# EAGLE design CircularControllerLEDs (EAGLE 8.0.0)
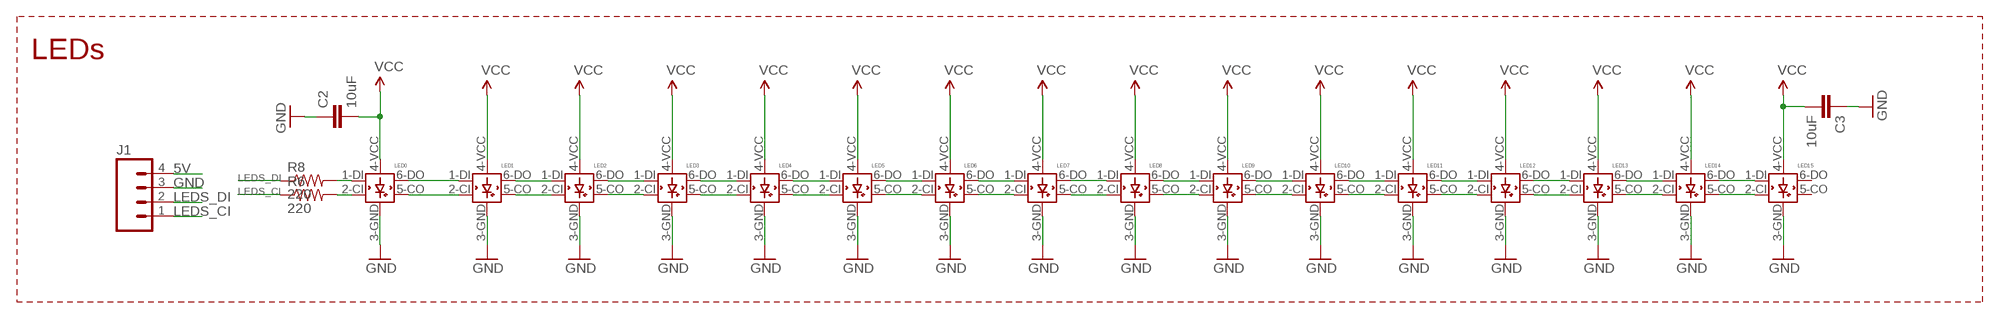
[diagram p0: schematic, sheet 1]

## Parts
C2  10uF  10UF-6.3V-20%(1206)  [1206]
C3  10uF  10UF-6.3V-20%(1206)  [1206]
J1  M04PTH  [1X04]
LED0  APA102  [5050]
LED1  APA102  [5050]
LED2  APA102  [5050]
LED3  APA102  [5050]
LED4  APA102  [5050]
LED5  APA102  [5050]
LED6  APA102  [5050]
LED7  APA102  [5050]
LED8  APA102  [5050]
LED9  APA102  [5050]
LED10  APA102  [5050]
LED11  APA102  [5050]
LED12  APA102  [5050]
LED13  APA102  [5050]
LED14  APA102  [5050]
LED15  APA102  [5050]
R6  220  RESISTOR1206  [1206]
R8  220  RESISTOR1206  [1206]

## Nets
5V: C2.2 J1.4 LED0.4-VCC(VCC) ; supply symbol labelled VCC
GND: C2.1 C3.1 J1.3 LED0.3-GND(GND) LED1.3-GND(GND) LED2.3-GND(GND) LED3.3-GND(GND) LED4.3-GND(GND) LED5.3-GND(GND) LED6.3-GND(GND) LED7.3-GND(GND) LED8.3-GND(GND) LED9.3-GND(GND) LED10.3-GND(GND) LED11.3-GND(GND) LED12.3-GND(GND) LED13.3-GND(GND) LED14.3-GND(GND) LED15.3-GND(GND)
LEDS_CI: J1.1 R6.1
LEDS_DI: J1.2 R8.1
N$1: LED0.1-DI(DI) R8.2
N$2: LED0.6-DO(DO) LED1.1-DI(DI)
N$3: LED0.2-CI(CI) R6.2
N$4: LED0.5-CO(CO) LED1.2-CI(CI)
N$5: LED1.6-DO(DO) LED2.1-DI(DI)
N$6: LED1.5-CO(CO) LED2.2-CI(CI)
N$7: LED2.6-DO(DO) LED3.1-DI(DI)
N$8: LED2.5-CO(CO) LED3.2-CI(CI)
N$9: LED3.5-CO(CO) LED4.2-CI(CI)
N$10: LED3.6-DO(DO) LED4.1-DI(DI)
N$11: LED4.6-DO(DO) LED5.1-DI(DI)
N$12: LED4.5-CO(CO) LED5.2-CI(CI)
N$13: LED5.6-DO(DO) LED6.1-DI(DI)
N$14: LED5.5-CO(CO) LED6.2-CI(CI)
N$15: LED6.6-DO(DO) LED7.1-DI(DI)
N$16: LED6.5-CO(CO) LED7.2-CI(CI)
N$17: LED7.5-CO(CO) LED8.2-CI(CI)
N$18: LED7.6-DO(DO) LED8.1-DI(DI)
N$19: LED8.6-DO(DO) LED9.1-DI(DI)
N$22: LED8.5-CO(CO) LED9.2-CI(CI)
N$23: LED9.6-DO(DO) LED10.1-DI(DI)
N$24: LED9.5-CO(CO) LED10.2-CI(CI)
N$26: LED10.6-DO(DO) LED11.1-DI(DI)
N$27: LED10.5-CO(CO) LED11.2-CI(CI)
N$28: LED11.6-DO(DO) LED12.1-DI(DI)
N$29: LED11.5-CO(CO) LED12.2-CI(CI)
N$30: LED12.6-DO(DO) LED13.1-DI(DI)
N$31: LED12.5-CO(CO) LED13.2-CI(CI)
N$32: LED13.6-DO(DO) LED14.1-DI(DI)
N$33: LED13.5-CO(CO) LED14.2-CI(CI)
N$34: LED14.6-DO(DO) LED15.1-DI(DI)
N$35: LED14.5-CO(CO) LED15.2-CI(CI)
VCC: C3.2 LED1.4-VCC(VCC) LED2.4-VCC(VCC) LED3.4-VCC(VCC) LED4.4-VCC(VCC) LED5.4-VCC(VCC) LED6.4-VCC(VCC) LED7.4-VCC(VCC) LED8.4-VCC(VCC) LED9.4-VCC(VCC) LED10.4-VCC(VCC) LED11.4-VCC(VCC) LED12.4-VCC(VCC) LED13.4-VCC(VCC) LED14.4-VCC(VCC) LED15.4-VCC(VCC)
Unconnected: LED15.5-CO(CO) LED15.6-DO(DO)

## Notes on the sheet
- LEDs

## Library data of the parts
C2 C3 = SparkFun-Capacitors:10UF-6.3V-20%(1206): CAP-10057 Ceramic; PROD_ID: CAP-10057
J1 = SparkFun-Connectors:M04: Header 4 Standard 4-pin 0.1" header. Use with straight break away headers (SKU : PRT-00116), right angle break away headers (PRT-00553), swiss pins (PRT-00743), machine pins (PRT-00117), and female headers (PRT-00115). Molex polarized connector foot print use with SKU : PRT-08231 with associated crimp pins and housings. 1MM SMD Version SKU: PRT-10208; PROD_ID: CONN-09696
LED0 LED1-LED15 = APA102:APA102: APA102C LED Specsheet <https://cdn-shop.adafruit.com/datasheets/APA102.pdf> Blog post <https://cpldcpu.wordpress.com/2014/08/27/apa102/> Adafruit <https://www.adafruit.com/products/2343>
R6 R8 = SparkFun-Resistors:RESISTOR: Resistor Basic schematic elements and footprints for 0603, 1206, and PTH resistors.

## Net classes
0 default: width 0.203 mm

## Board
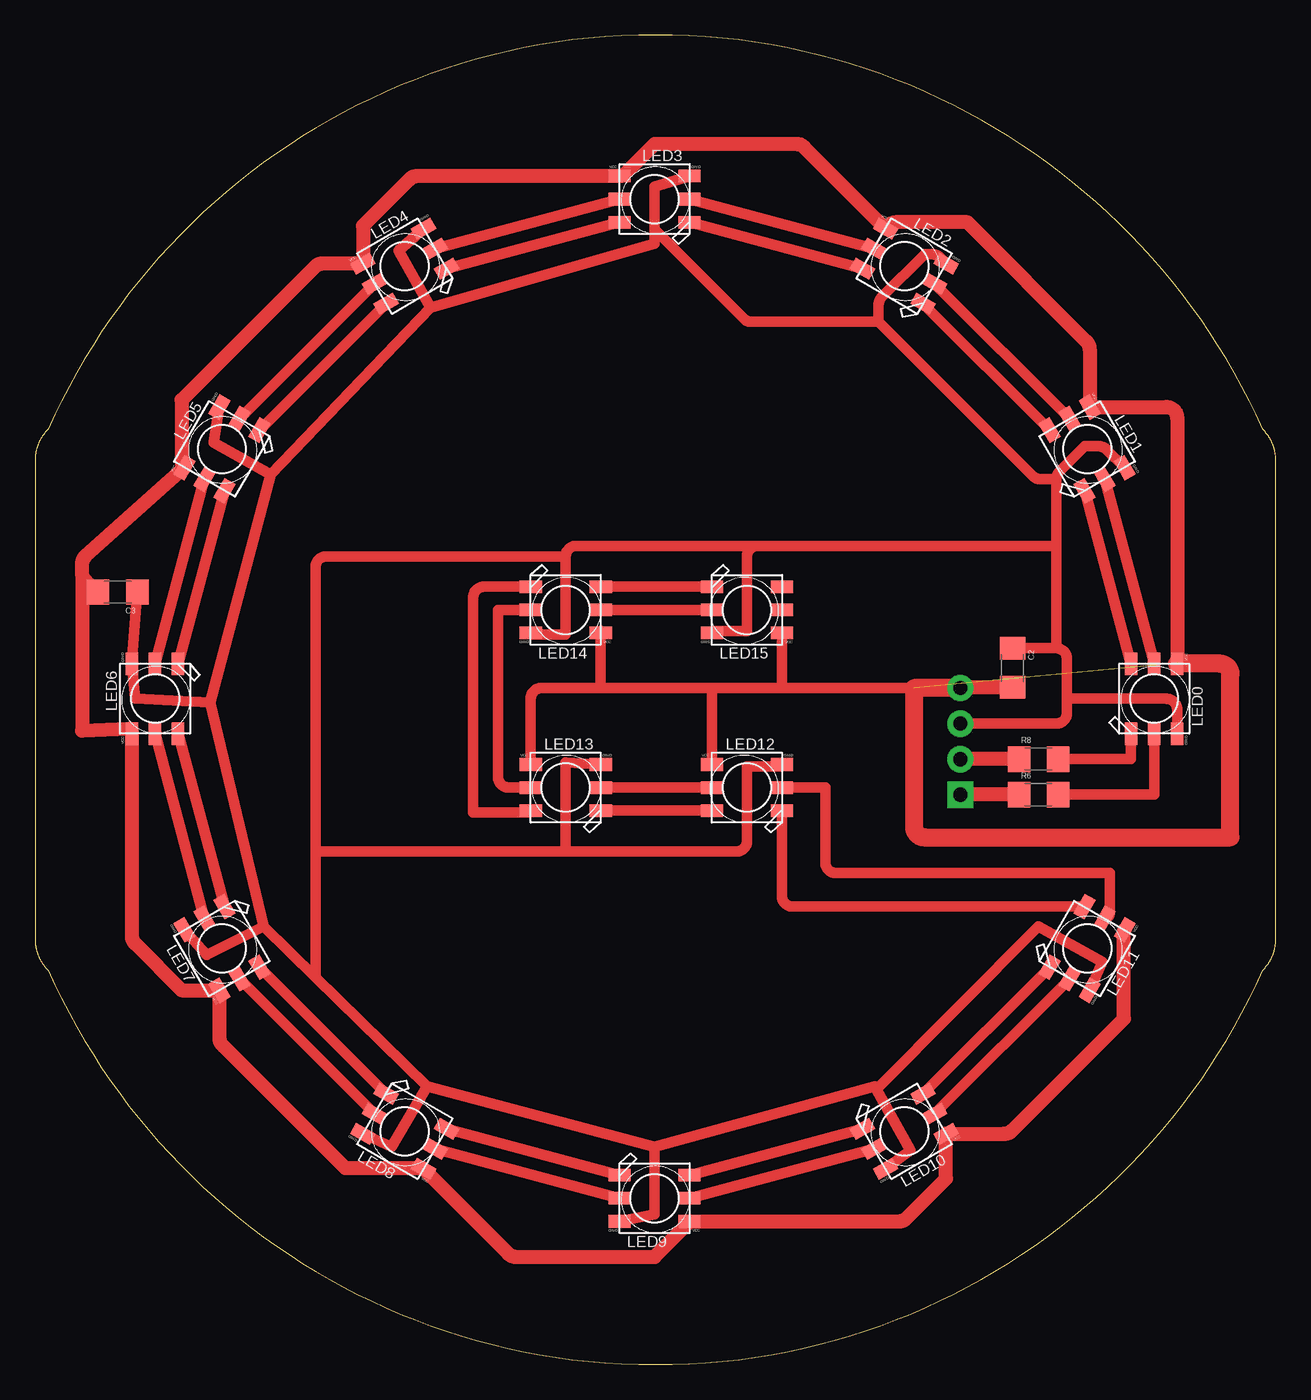
[diagram p1: board, top side]
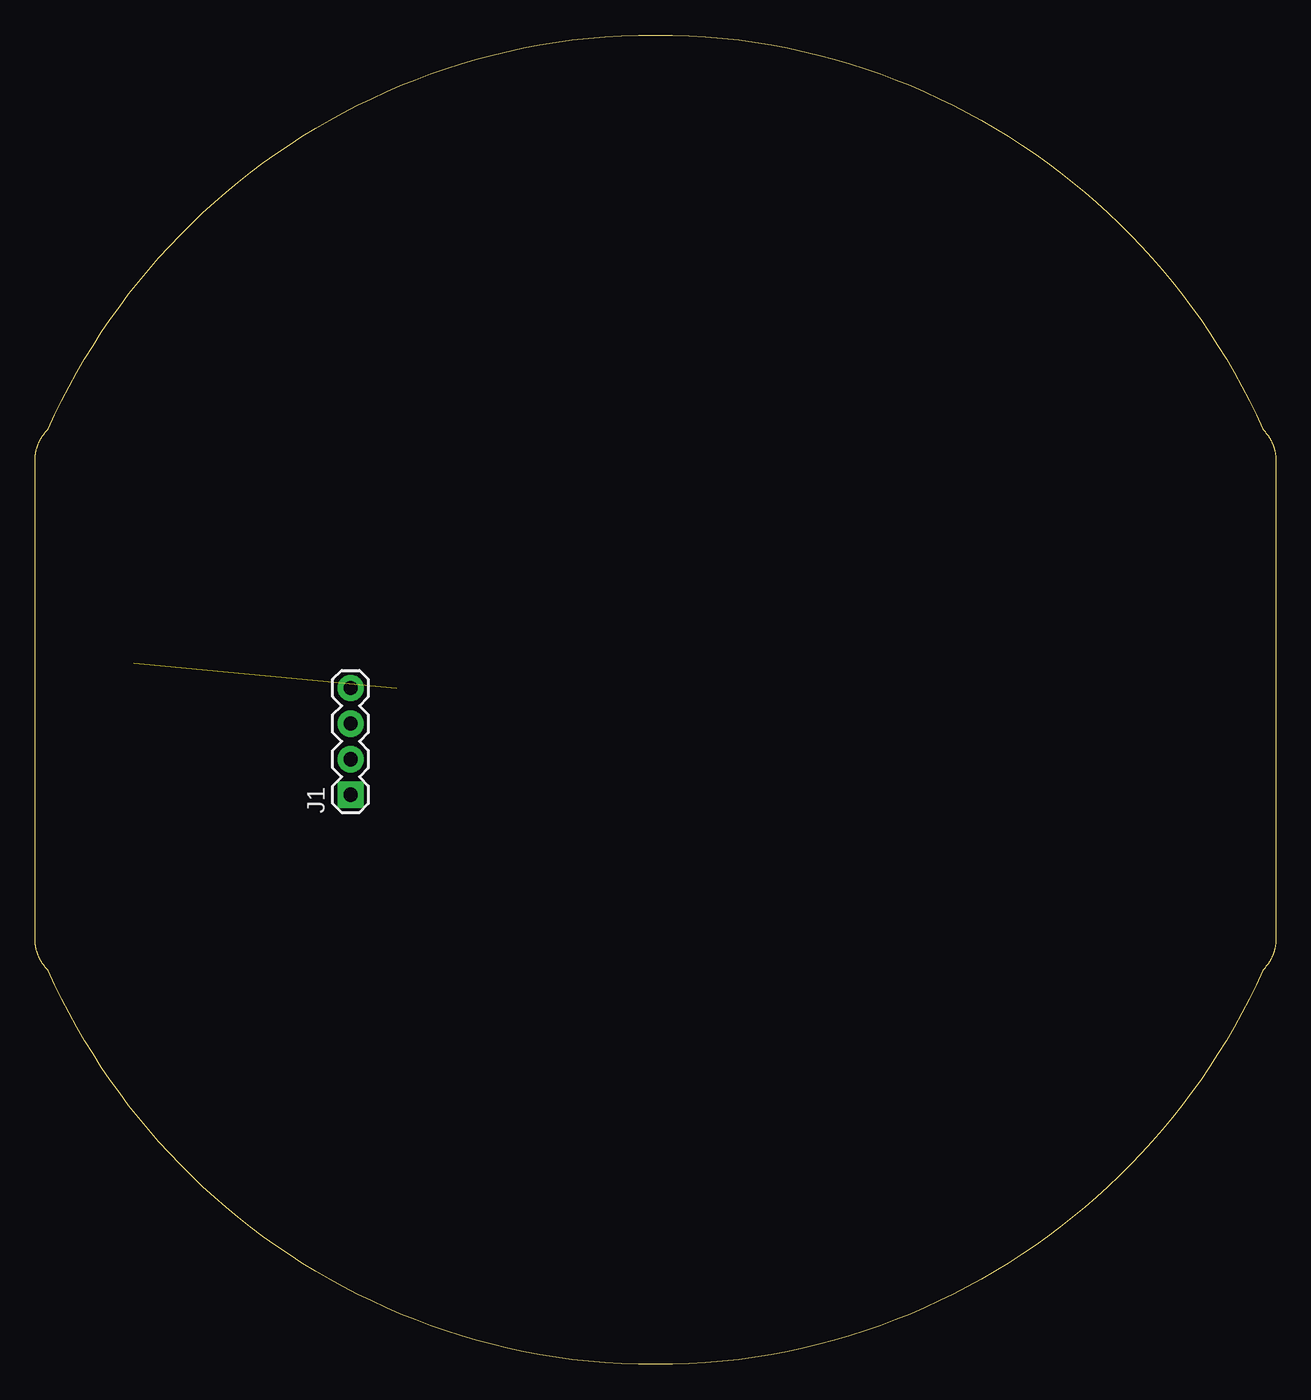
[diagram p2: board, bottom side, seen from below]

Size 88.65 x 94.98 mm. Coordinates in mm from the lower left corner, seen from the top.
Outline: 87.7,66.82 87.24,67.86 86.74,68.88 86.21,69.87 85.67,70.87 85.1,71.84 84.5,72.79 83.9,73.75 83.27,74.68 82.6,75.58 81.94,76.48 81.24,77.37 80.52,78.22 79.79,79.07 79.04,79.9 78.25,80.7 77.47,81.5 76.66,82.28 75.82,83.02 74.98,83.76 74.12,84.48 73.23,85.16 72.34,85.85 71.43,86.5 70.49,87.12 69.55,87.74 68.59,88.33 67.61,88.88 66.62,89.44 65.62,89.96 64.6,90.44 63.57,90.93 62.53,91.38 61.46,91.79 60.4,92.2 59.32,92.58 58.22,92.91 57.12,93.25 56,93.54 53.74,94.06 52.6,94.27 51.44,94.45 50.28,94.62 49.1,94.76 47.92,94.84 46.73,94.93 45.53,94.98 43.11,94.98 41.92,94.93 40.73,94.84 39.54,94.76 38.37,94.62 37.21,94.45 36.05,94.27 34.9,94.06 32.64,93.54 31.53,93.25 30.43,92.91 29.33,92.58 28.25,92.2 27.18,91.79 26.12,91.38 25.08,90.93 24.05,90.44 23.03,89.96 22.02,89.44 21.04,88.88 20.06,88.33 19.1,87.74 18.16,87.12 17.22,86.5 16.31,85.85 15.42,85.16 14.53,84.48 13.66,83.76 12.83,83.02 11.99,82.28 11.18,81.5 10.39,80.7 9.61,79.9 8.85,79.07 8.13,78.22 7.4,77.37 6.71,76.48 6.04,75.58 5.38,74.68 4.74,73.75 4.14,72.79 3.54,71.84 2.97,70.87 2.44,69.87 1.91,68.88 1.41,67.86 0.95,66.82 0.91,66.79 0.87,66.75 0.84,66.71 0.8,66.67 0.77,66.64 0.74,66.6 0.71,66.56 0.67,66.52 0.64,66.48 0.61,66.43 0.58,66.39 0.55,66.35 0.52,66.31 0.5,66.27 0.47,66.22 0.44,66.18 0.42,66.13 0.39,66.09 0.37,66.04 0.34,66 0.32,65.95 0.3,65.9 0.27,65.86 0.25,65.81 0.23,65.76 0.21,65.71 0.2,65.66 0.18,65.62 0.16,65.57 0.15,65.52 0.13,65.47 0.12,65.42 0.1,65.36 0.09,65.31 0.08,65.26 0.07,65.21 0.06,65.16 0.05,65.11 0.04,65.05 0.03,65 0.02,64.95 0.02,64.89 0.01,64.84 0.01,64.78 0,64.73 0,64.68 0,64.62 0,30.36 0,30.3 0,30.25 0.01,30.19 0.01,30.14 0.02,30.09 0.02,30.03 0.03,29.98 0.04,29.93 0.05,29.87 0.06,29.82 0.07,29.77 0.08,29.72 0.09,29.67 0.1,29.61 0.12,29.56 0.13,29.51 0.15,29.46 0.16,29.41 0.18,29.36 0.2,29.31 0.21,29.27 0.23,29.22 0.25,29.17 0.27,29.12 0.3,29.08 0.32,29.03 0.34,28.98 0.37,28.94 0.39,28.89 0.42,28.85 0.44,28.8 0.47,28.76 0.5,28.71 0.52,28.67 0.55,28.63 0.58,28.59 0.61,28.54 0.67,28.46 0.71,28.42 0.74,28.38 0.77,28.34 0.8,28.31 0.84,28.27 0.87,28.23 0.91,28.19 0.95,28.16 1.41,27.12 1.91,26.1 2.44,25.11 2.97,24.11 3.54,23.14 4.14,22.18 4.74,21.23 5.38,20.3 6.04,19.4 6.71,18.49 7.4,17.61 8.13,16.76 8.85,15.9 9.61,15.08 10.39,14.28 11.18,13.48 11.99,12.7 12.83,11.96 13.66,11.21 14.53,10.5 15.42,9.82 16.31,9.13 17.22,8.48 18.16,7.86 19.1,7.24 20.06,6.65 21.04,6.09 22.02,5.54 23.03,5.02 24.05,4.54 25.08,4.05 26.12,3.6 27.18,3.19 28.25,2.78 29.33,2.4 30.43,2.07 31.53,1.73 32.64,1.43 33.77,1.18 34.9,0.92 36.05,0.7 37.21,0.53 38.37,0.36 39.54,0.22 40.73,0.13 41.92,0.05 43.11,0 45.53,0 46.73,0.05 47.92,0.13 49.1,0.22 50.28,0.36 51.44,0.53 52.6,0.7 53.74,0.92 54.87,1.18 56,1.43 57.12,1.73 58.22,2.07 59.32,2.4 60.4,2.78 61.46,3.19 62.53,3.6 63.57,4.05 64.6,4.54 65.62,5.02 66.62,5.54 67.61,6.09 68.59,6.65 69.55,7.24 70.49,7.86 71.43,8.48 72.34,9.13 73.23,9.82 74.12,10.5 74.98,11.21 75.82,11.96 76.66,12.7 77.47,13.48 78.25,14.28 79.04,15.08 79.79,15.9 80.52,16.76 81.24,17.61 81.94,18.49 82.6,19.4 83.27,20.3 83.9,21.23 84.5,22.18 85.1,23.14 85.67,24.11 86.21,25.11 86.74,26.1 87.24,27.12 87.7,28.16 87.74,28.19 87.77,28.23 87.81,28.27 87.84,28.31 87.88,28.34 87.91,28.38 87.94,28.42 87.97,28.46 88,28.5 88.03,28.54 88.06,28.59 88.09,28.63 88.12,28.67 88.15,28.71 88.18,28.76 88.2,28.8 88.23,28.85 88.26,28.89 88.28,28.94 88.3,28.98 88.35,29.08 88.37,29.12 88.39,29.17 88.41,29.22 88.43,29.27 88.45,29.31 88.47,29.36 88.48,29.41 88.5,29.46 88.52,29.51 88.53,29.56 88.54,29.61 88.56,29.67 88.57,29.72 88.58,29.77 88.59,29.82 88.6,29.87 88.61,29.93 88.62,29.98 88.62,30.03 88.63,30.09 88.63,30.14 88.64,30.19 88.64,30.25 88.64,30.3 88.65,30.36 88.65,64.62 88.64,64.68 88.64,64.73 88.64,64.78 88.63,64.84 88.63,64.89 88.62,64.95 88.62,65 88.61,65.05 88.6,65.11 88.59,65.16 88.58,65.21 88.57,65.26 88.56,65.31 88.54,65.36 88.53,65.42 88.52,65.47 88.5,65.52 88.48,65.57 88.47,65.62 88.45,65.66 88.43,65.71 88.41,65.76 88.39,65.81 88.37,65.86 88.35,65.9 88.3,66 88.28,66.04 88.26,66.09 88.23,66.13 88.2,66.18 88.18,66.22 88.15,66.27 88.12,66.31 88.09,66.35 88.06,66.39 88.03,66.43 88,66.48 87.97,66.52 87.94,66.56 87.91,66.6 87.88,66.64 87.84,66.67 87.81,66.71 87.77,66.75 87.74,66.79 87.7,66.82
Copper layers (1*16): Top 0.035mm / dielectric 1.5mm / Bottom 0.035mm
Design rules "OthermillDRC_1_64_v2": minimum track width 16mil, minimum drill 31mil, track to track 0.39878125mm, track to pad 0.39878125mm, pad to pad 0.39878125mm, via to via 0.39878125mm, smd to smd 0mil, copper to edge 0mil, drill to drill 1mil, minimum pad ring 0mil, minimum via ring 15mil, stop-mask expansion 1mil, vias tented up to drill 30mil, thermal gap 10mil

### Footprints (pad centres in the part's own frame; a part is rotated, then mirrored left to right if it is on the bottom)
1206 = smd 1.6 x 1.8: 1 -1.4,0; 2 1.4,0
1X04 = drill 1.016 pad 1.88 square: 1 0,0 | drill 1.016 pad 1.88: 2 2.54,0; 3 5.08,0; 4 7.62,0
5050 = smd 1.6 x 0.9: 1-DI -2.5,1.65; 2-CI -2.5,0; 3-GND -2.5,-1.65; 4-VCC 2.5,-1.65; 5-CO 2.5,0; 6-DO 2.5,1.65

### Placement (x,y rotation side)
C2  69.84,49.77 270 top
C3  5.91,55.18 180 top
J1  66.1,40.71 90 bottom
LED0  79.95,47.56 90 top
LED1  75.17,65.41 120 top
LED2  62.1,78.47 150 top
LED3  44.26,83.25 180 top
LED4  26.42,78.47 210 top
LED5  13.35,65.41 240 top
LED6  8.57,47.56 270 top
LED7  13.35,29.72 300 top
LED8  26.42,16.66 330 top
LED9  44.26,11.88 0 top
LED10  62.1,16.66 30 top
LED11  75.17,29.72 60 top
LED12  50.86,41.21 180 top
LED13  37.91,41.21 180 top
LED14  37.91,53.91 0 top
LED15  50.86,53.91 0 top
R6  71.69,40.71 0 top
R8  71.69,43.25 0 top

### Tracks (layer width: path | path; a pad name or v marks a point on that pad's centre or on a via)
5V
  Top 1.016: C2.2 66.1,48.37 J1.4
  Top 1.27: J1.4 62.8,48.33 62.8,38.42 arc90 63.56,37.66 85.41,37.66 85.41,49.3 arc90 84.65,50.06 LED0.4-VCC
GND
  Top 0.762: LED0.3-GND 81.6,46.8 arc90 80.83,47.56 73.72,47.56 | 73.72,47.56 73.72,46.55 arc-90 72.96,45.79 J1.3 | 73.72,47.56 73.72,50.41 arc90 72.96,51.17 | 72.96,51.17 C2.1 | 72.96,51.17 72.96,58.49 | 72.96,58.49 72.96,63.25 | 72.96,63.25 arc-45 73.18,63.79 74.99,65.6 76,65.6 arc-45 76.54,65.37 LED1.3-GND | 72.96,63.25 71.81,63.25 arc-45 71.28,63.47 60.26,74.49 | 60.26,74.49 60.26,75.7 arc-45 60.48,76.23 63.56,79.31 64.11,79.31 arc-45 64.65,79.09 LED2.3-GND | 60.26,74.49 51.18,74.49 arc-45 50.64,74.71 44.26,81.09 | 44.26,81.09 44.26,84.14 LED3.3-GND | 44.26,81.09 44.26,80.08 28.26,75.5 | 28.26,75.5 25.97,79.57 LED4.3-GND | 28.26,75.5 16.83,63.57 | 16.83,63.57 12.76,65.85 LED5.3-GND | 16.83,63.57 12.51,47.31 | 12.51,47.31 7.18,47.56 LED6.3-GND C3.1 | 12.51,47.31 16.32,31.31 | 16.32,31.31 12.26,29.28 LED7.3-GND | 20.04,27.66 16.32,31.31 | 20.04,27.66 28,19.88 | 28,19.88 25.46,15.56 LED8.3-GND | 28,19.88 44.26,15.56 | 44.26,15.56 44.26,10.73 LED9.3-GND | 44.26,15.56 60.01,19.88 60.13,19.66 | 60.13,19.66 62.55,15.31 LED10.3-GND | 60.13,19.66 71.69,31.31 76.26,28.77 LED11.3-GND | LED13.3-GND 37.91,42.99 37.91,36.64 | 72.96,58.49 51.63,58.49 | 51.63,58.49 arc90 50.86,57.72 50.86,52.39 48.49,52.39 arc90 LED15.3-GND | LED12.3-GND arc-90 53.24,42.74 50.86,42.74 50.86,37.4 arc-90 50.1,36.64 37.91,36.64 | 51.63,58.49 38.67,58.49 arc90 37.91,57.72 | 37.91,57.72 37.91,52.14 35.54,52.14 arc-90 LED14.3-GND | 37.91,57.72 20.81,57.72 arc90 20.04,56.96 20.04,36.64 | 20.04,36.64 20.04,27.66 | 37.91,36.64 20.04,36.64
LEDS_CI
  Top 1.016: R6.1 J1.1
LEDS_DI
  Top 1.016: R8.1 J1.2
N$1
  Top 0.762: R8.2 78.3,43.25 LED0.1-DI
N$2
  Top 0.762: LED0.6-DO LED1.1-DI
N$3
  Top 0.762: R6.2 79.95,40.71 LED0.2-CI
N$4
  Top 0.762: LED0.5-CO LED1.2-CI
N$5
  Top 0.762: LED1.6-DO LED2.1-DI
N$6
  Top 0.762: LED1.5-CO LED2.2-CI
N$7
  Top 0.762: LED2.6-DO LED3.1-DI
N$8
  Top 0.762: LED3.2-CI LED2.5-CO
N$9
  Top 0.762: LED4.2-CI LED3.5-CO
N$10
  Top 0.762: LED3.6-DO LED4.1-DI
N$11
  Top 0.762: LED4.6-DO LED5.1-DI
N$12
  Top 0.762: LED5.2-CI LED4.5-CO
N$13
  Top 0.762: LED5.6-DO LED6.1-DI
N$14
  Top 0.762: LED5.5-CO LED6.2-CI
N$15
  Top 0.762: LED6.6-DO LED7.1-DI
N$16
  Top 0.762: LED6.5-CO LED7.2-CI
N$17
  Top 0.762: LED7.5-CO LED8.2-CI
N$18
  Top 0.762: LED7.6-DO LED8.1-DI
N$19
  Top 0.762: LED8.6-DO LED9.1-DI
N$22
  Top 0.762: LED8.5-CO LED9.2-CI
N$23
  Top 0.762: LED9.6-DO LED10.1-DI
N$24
  Top 0.762: LED9.5-CO LED10.2-CI
N$26
  Top 0.762: LED10.6-DO LED11.1-DI
N$27
  Top 0.762: LED10.5-CO LED11.2-CI
N$28
  Top 0.762: LED11.6-DO 54.13,32.71 arc-90 53.36,33.47 LED12.1-DI
N$29
  Top 0.762: LED11.5-CO arc90 76.77,32.24 76.77,35.12 57.21,35.12 arc-90 56.45,35.88 56.45,41.21 LED12.2-CI
N$30
  Top 0.762: LED12.6-DO LED13.1-DI
N$31
  Top 0.762: LED12.5-CO LED13.2-CI
N$32
  Top 0.762: LED14.1-DI 32.07,55.56 arc90 31.31,54.8 31.31,39.44 35.28,39.44 arc90 LED13.6-DO
N$33
  Top 0.762: LED13.5-CO 33.85,41.21 arc-90 33.08,41.98 33.08,53.91 LED14.2-CI
N$34
  Top 0.762: LED14.6-DO LED15.1-DI
N$35
  Top 0.762: LED14.5-CO LED15.2-CI
VCC  (1 unrouted)
  Top 0.762: C3.2 3.37,56.45 | LED13.4-VCC 35.41,47.56 arc-90 36.17,48.33 40.2,48.33 | 48.07,48.33 40.2,48.33 | 53.4,48.33 48.07,48.33 | 53.4,48.33 62.8,48.33 | LED14.4-VCC 40.41,48.54 arc-90 40.2,48.33 | LED12.4-VCC 48.36,48.03 arc90 48.07,48.33 | LED15.4-VCC 53.36,48.37 arc90 53.4,48.33
  Top 1.016: LED11.4-VCC arc45 77.79,30.92 77.79,24.7 69.79,16.7 arc-45 69.25,16.48 LED10.4-VCC arc45 65.09,16.47 65.09,13.27 62.26,10.45 arc-45 61.72,10.23 LED9.4-VCC arc-45 46.73,10.16 44.26,7.69 34.36,7.69 arc-45 33.83,7.91 LED8.4-VCC arc45 27.62,14.04 22.16,14.04 13.4,22.8 arc-45 13.17,23.34 LED7.4-VCC arc45 13.16,26.74 10.48,26.74 7.15,30.07 arc-45 6.92,30.61 LED6.4-VCC arc45 6.77,45.43 3.37,45.28 3.37,56.45 3.37,57.2 arc-45 3.59,57.74 LED5.4-VCC arc-45 10.48,64.54 10.48,68.9 20,78.43 arc-45 20.54,78.65 LED4.4-VCC arc45 23.43,78.66 23.43,81.35 26.76,84.68 arc-45 27.3,84.9 LED3.4-VCC arc45 42.12,85.05 44.26,87.19 54.41,87.19 arc-45 54.95,86.96 LED2.4-VCC 60.99,81.38 arc-45 61.53,81.6 66.61,81.6 75.12,73.09 arc-45 75.34,72.55 LED1.4-VCC 80.84,68.4 arc-90 81.6,67.64 81.6,50.1 | 40.45,52.22 arc90 LED14.4-VCC